# EAGLE design Oh_Oh-BOT_v001 (EAGLE 5.06)
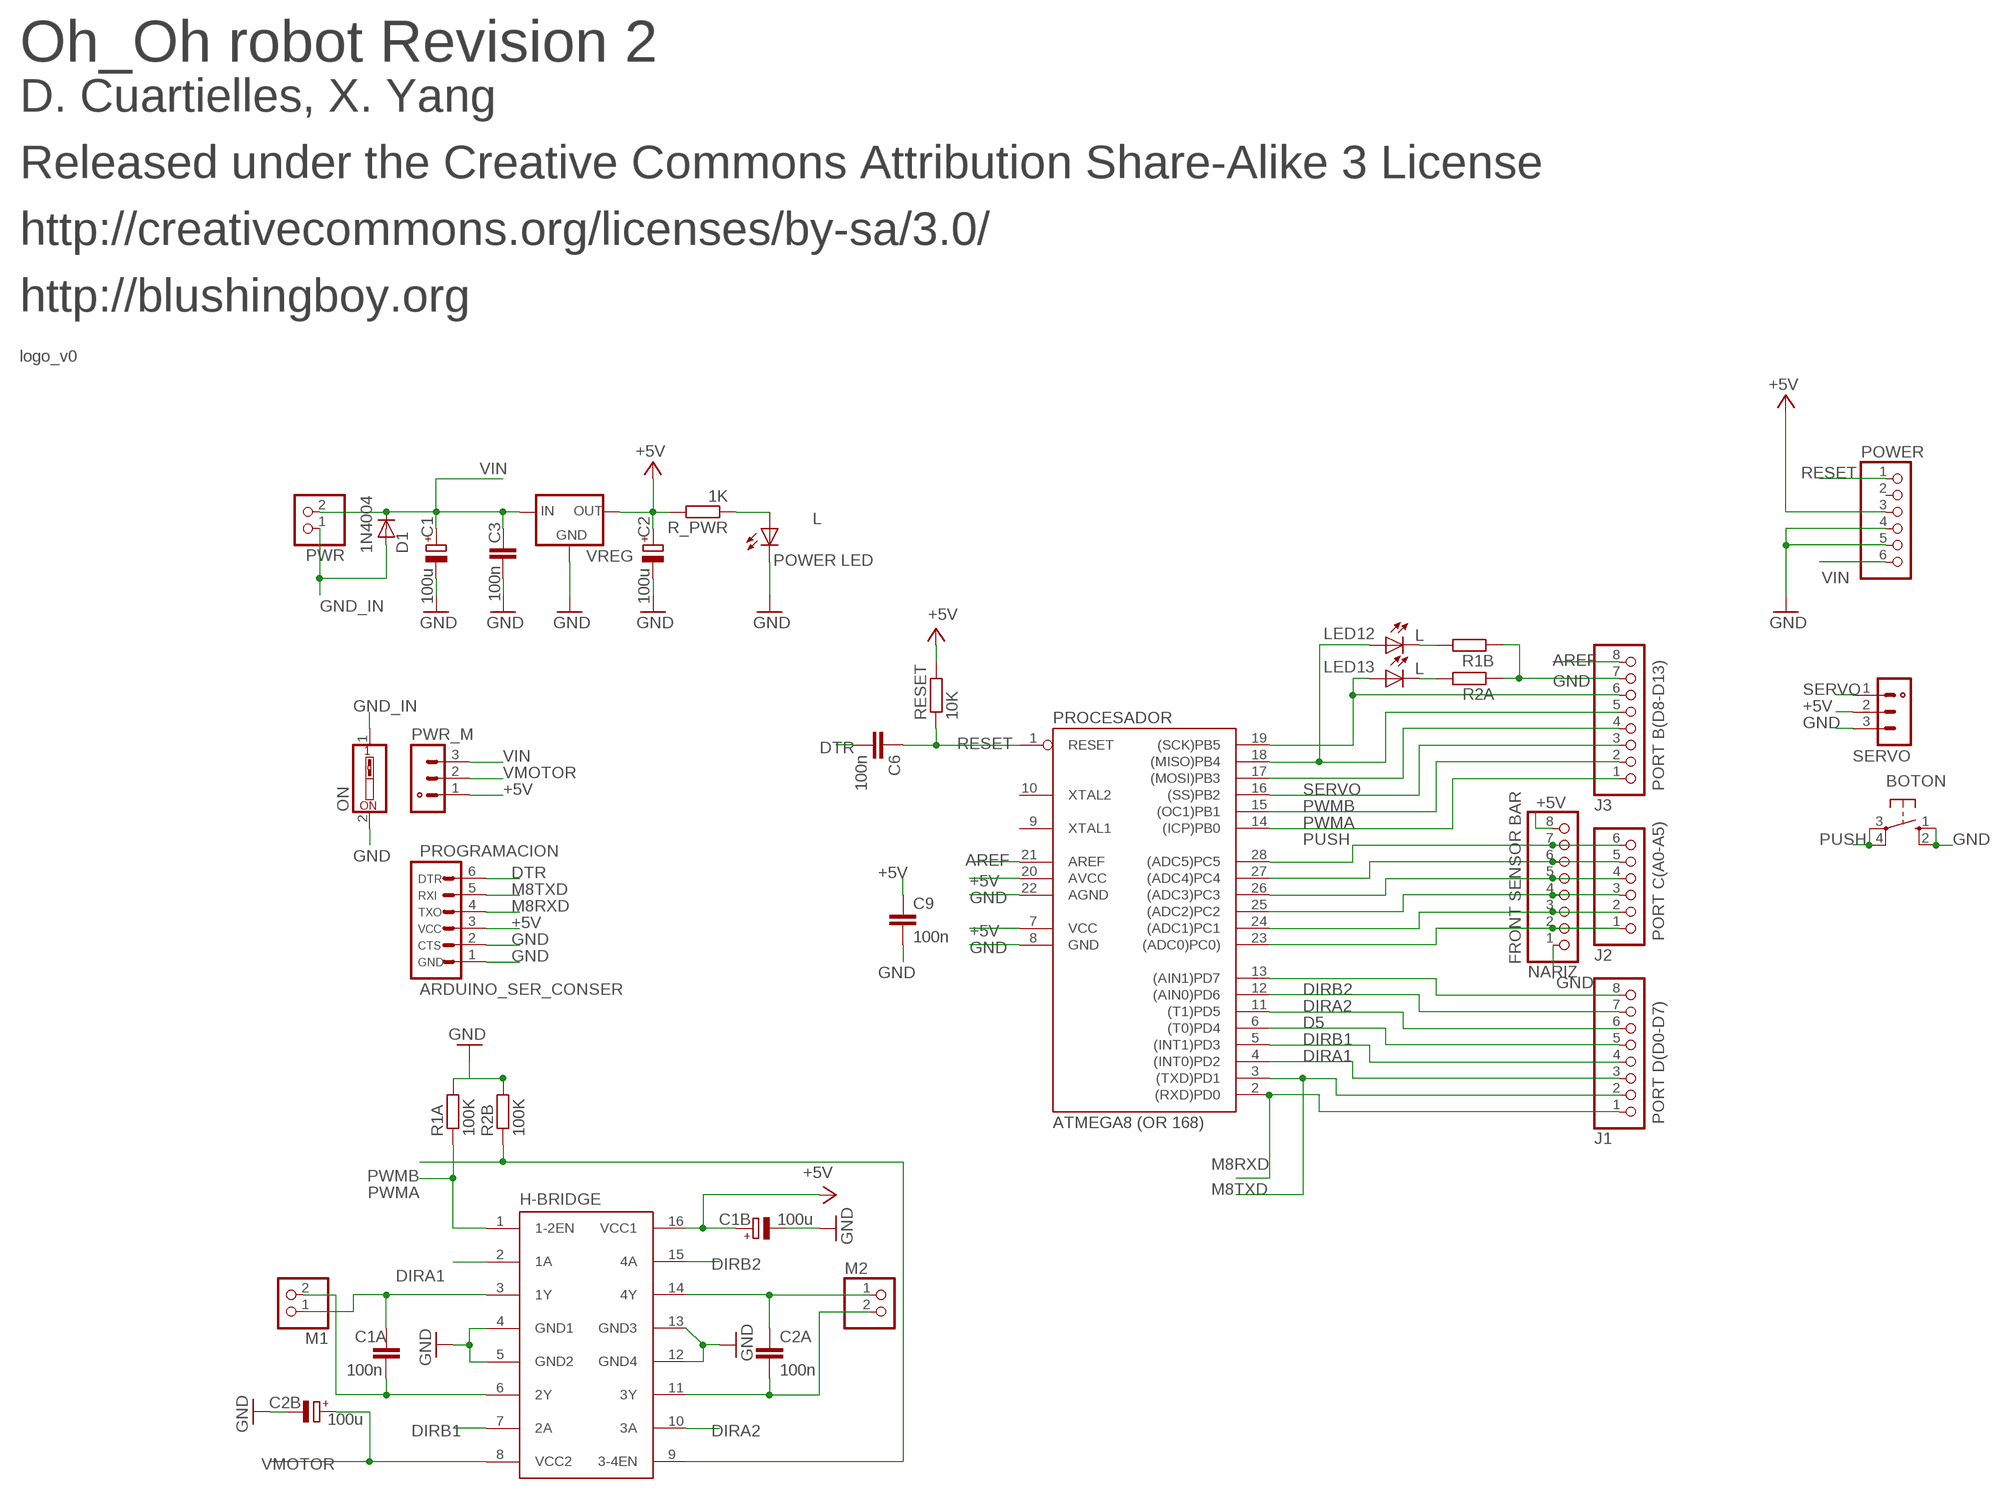
[diagram p0: schematic, sheet 1]

## Parts
BOTON  10-XX  [B3F-10XX]
C1  100u  C-POLE3,5-8  [E3,5-8]
C1A  100n  CC050X075_ARTY  [C050-025X075_ARTY]
C1B  100u  C-POLE3,5-8  [E3,5-8]
C2  100u  C-POLE3,5-8  [E3,5-8]
C2A  100n  CC050X075_ARTY  [C050-025X075_ARTY]
C2B  100u  C-POLE3,5-8  [E3,5-8]
C3  100n  CC050X075_ARTY  [C050-025X075_ARTY]
C6  100n  CC050X075_ARTY  [C050-025X075_ARTY]
C9  100n  CC050X075_ARTY  [C050-025X075_ARTY]
D1  1N4004  [DO41-10]
H-BRIDGE  L293E  [DIL16]
J1  PORT D(D0-D7)  PINHD-1X8  [1X08]
J2  PORT C(A0-A5)  PINHD-1X6  [1X06]
J3  PORT B(D8-D13)  PINHD-1X8  [1X08]
L  POWER LED  LED3MM  [LED3MM]
LED12  L  LED3MM  [LED3MM]
LED13  L  LED3MM  [LED3MM]
M1  PINHD-1X2  [1X02]
M2  PINHD-1X2  [1X02]
NARIZ  FRONT SENSOR BAR  PINHD-1X8  [1X08]
ON  SW_DIP-1  [EDG-01]
POWER  PINHD-1X6  [1X06]
PROCESADOR  ATMEGA8 (OR 168)  AT90S4433P  [DIL28-3]
PROGRAMACION  ARDUINO_SER_CONSER  [ARDUINO_SER_COM]
PWR  PINHD-1X2  [1X02]
PWR_M  MA03-1_BB  [MA03-1_BB]
R1A  100K  RR0207/10  [R0207/10]
R1B  RR0207/10  [R0207/10]
R2A  RR0207/10  [R0207/10]
R2B  100K  RR0207/10  [R0207/10]
R_PWR  1K  RR0207/10  [R0207/10]
RESET  10K  RR0207/10  [R0207/10]
SERVO  MA03-1_BB  [MA03-1_BB]
U$4  LOGO_V0  [LOGO_V0]
VREG  78XXS  [78XXS]

## Nets
+5V [power]: C1B.+ C2.+ C9.1 H-BRIDGE.16(VCC1) NARIZ.8 POWER.3 PROCESADOR.7(VCC) PROCESADOR.20(AVCC) PROGRAMACION.3 PWR_M.1 R_PWR.2 RESET.2 SERVO.2 VREG.OUT
AREF: J3.8 PROCESADOR.21(AREF)
D5: J1.6 PROCESADOR.11((T1)PD5)
DIRA1: H-BRIDGE.2(1A) J1.4 PROCESADOR.5((INT1)PD3)
DIRA2: H-BRIDGE.10(3A) J1.7 PROCESADOR.12((AIN0)PD6)
DIRB1: H-BRIDGE.7(2A) J1.5 PROCESADOR.6((T0)PD4)
DIRB2: H-BRIDGE.15(4A) J1.8 PROCESADOR.13((AIN1)PD7)
DTR: C6.2 PROGRAMACION.6
GND: BOTON.1(S) BOTON.2(S1) C1.- C1B.- C2.- C2B.- C3.2 C9.2 H-BRIDGE.4(GND1) H-BRIDGE.5(GND2) H-BRIDGE.12(GND4) H-BRIDGE.13(GND3) J3.7 L.K(C) NARIZ.1 ON.2 POWER.4 POWER.5 PROCESADOR.8(GND) PROCESADOR.22(AGND) PROGRAMACION.1 PROGRAMACION.2 R1A.2 R1B.1 R2A.1 R2B.2 SERVO.3 VREG.GND
GND_IN: D1.A ON.1 PWR.1
M8RXD: J1.1 PROCESADOR.2((RXD)PD0) PROGRAMACION.4
M8TXD: J1.2 PROCESADOR.3((TXD)PD1) PROGRAMACION.5
N$2: C1A.1 H-BRIDGE.3(1Y) M1.1
N$3: L.A R_PWR.1
N$5: LED12.K(C) R1B.2
N$9: C1A.2 H-BRIDGE.6(2Y) M1.2
N$10: J1.3 PROCESADOR.4((INT0)PD2)
N$16: J2.1 NARIZ.2 PROCESADOR.23((ADC0)PC0))
N$17: J2.2 NARIZ.3 PROCESADOR.24((ADC1)PC1)
N$18: J2.3 NARIZ.4 PROCESADOR.25((ADC2)PC2)
N$19: J2.4 NARIZ.5 PROCESADOR.26((ADC3)PC3)
N$20: J2.5 NARIZ.6 PROCESADOR.27((ADC4)PC4)
N$21: J2.6 NARIZ.7 PROCESADOR.28((ADC5)PC5)
N$31: LED13.K(C) R2A.2
N$32: C2A.2 H-BRIDGE.11(3Y) M2.2
N$33: C2A.1 H-BRIDGE.14(4Y) M2.1
PUSH: BOTON.3(P) BOTON.4(P1) J3.1 PROCESADOR.14((ICP)PB0)
PWMA: H-BRIDGE.1(1-2EN) J3.2 PROCESADOR.15((OC1)PB1) R1A.1
PWMB: H-BRIDGE.9(3-4EN) J3.3 PROCESADOR.16((SS)PB2) R2B.1
RESET: C6.1 POWER.1 PROCESADOR.1(RESET) RESET.1
SCK: J3.6 LED13.A PROCESADOR.19((SCK)PB5)
SCK1: J3.5 LED12.A PROCESADOR.18((MISO)PB4)
SERVO: J3.4 PROCESADOR.17((MOSI)PB3) SERVO.1
VIN [power]: C1.+ C3.1 D1.C POWER.6 PWR.2 PWR_M.3 VREG.IN
VMOTOR: C2B.+ H-BRIDGE.8(VCC2) PWR_M.2
Unconnected: POWER.2 PROCESADOR.9(XTAL1) PROCESADOR.10(XTAL2)

## Notes on the sheet
- Oh_Oh robot Revision 2
- D. Cuartielles, X. Yang
- Released under the Creative Commons Attribution Share-Alike 3 License
- http://creativecommons.org/licenses/by-sa/3.0/
- http://blushingboy.org

## Library data of the parts
BOTON = switch-omron:10-XX: OMRON SWITCH
C1 C1B C2 C2B = blushingboy_experimental:C-POL
C1A C2A C3 C6 C9 = blushingboy_experimental:C
D1 = diode:1N4004: DIODE general purpose rectifier, 1 A
H-BRIDGE = texas:L293E: TI DEVICE
J1 J3 NARIZ = pinhead:PINHD-1X8: PIN HEADER
J2 POWER = pinhead:PINHD-1X6: PIN HEADER
L LED12 LED13 = led:LED: LED OSRAM: - CHIPLED LG R971, LG N971, LY N971, LG Q971, LY Q971, LO R971, LY R971 LH N974, LH R974 LS Q976, LO Q976, LY Q976 LO Q996 - Hyper CHIPLED LW Q18S LB Q993, LB Q99A, LB R99A - SideLED LS A670, LO A670, LY A670, LG A670, LP A670 LB A673, LV A673, LT A673, LW A673 LH A674 LY A675 LS A676, LA A676, LO A676, LY A676, LW A676 LS A679, LY A679, LG A679 - Hyper Micro SIDELED® LS Y876, LA Y876, LO Y876, LY Y876 LT Y87S - SmartLED LW L88C, LW L88S LB L89C, LB L89S, LG L890 LS L89K, LO L89K, LY L89K LS L896, LA L896, LO L896, LY L896 - TOPLED LS T670, LO T670, LY T670, LG T670, LP T670 LSG T670, LSP T670, LSY T670, LOP T670, LYG T670 LG T671, LOG T671, LSG T671 LB T673, LV T673, LT T673, LW T673 LH T674 LS T676, LA T676, LO T676, LY T676, LB T676, LH T676, LSB T676, LW T676 LB T67C, LV T67C, LT T67C, LS T67K, LO T67K, LY T67K, LW E67C LS E67B, LA E67B, LO E67B, LY E67B, LB E67C, LV E67C, LT E67C LW T67C LS T679, LY T679, LG T679 LS T770, LO T770, LY T770, LG T770, LP T770 LB T773, LV T773, LT T773, LW T773 LH T774 LS E675, LA E675, LY E675, LS T675 LS T776, LA T776, LO T776, LY T776, LB T776 LHGB T686 LT T68C, LB T68C - Hyper Mini TOPLED® LB M676 - Mini TOPLED Santana® LG M470 LS M47K, LO M47K, LY M47K Source: http://www.osram.convergy.de/
M1 M2 PWR = pinhead:PINHD-1X2: PIN HEADER
ON = special:SW_DIP-1: DIP SWITCH
PROCESADOR = atmel:AT90S4433: MICROCONTROLLER 4 Kbytes FLASH 128 bytes SRAM 256 bytes EEPROM UART 6-channel 10 bit ADC
PROGRAMACION = SparkFun:ARDUINO_SER_CON
PWR_M SERVO = blushingboy_experimental:MA03-1_BB
R1A R1B R2A R2B R_PWR RESET = blushingboy_experimental:R
U$4 = blushingboy_experimental:LOGO_V0
VREG = v-reg:78XXS: VOLTAGE REGULATOR

## Net classes
1 power: width 0.61 mm

## Board
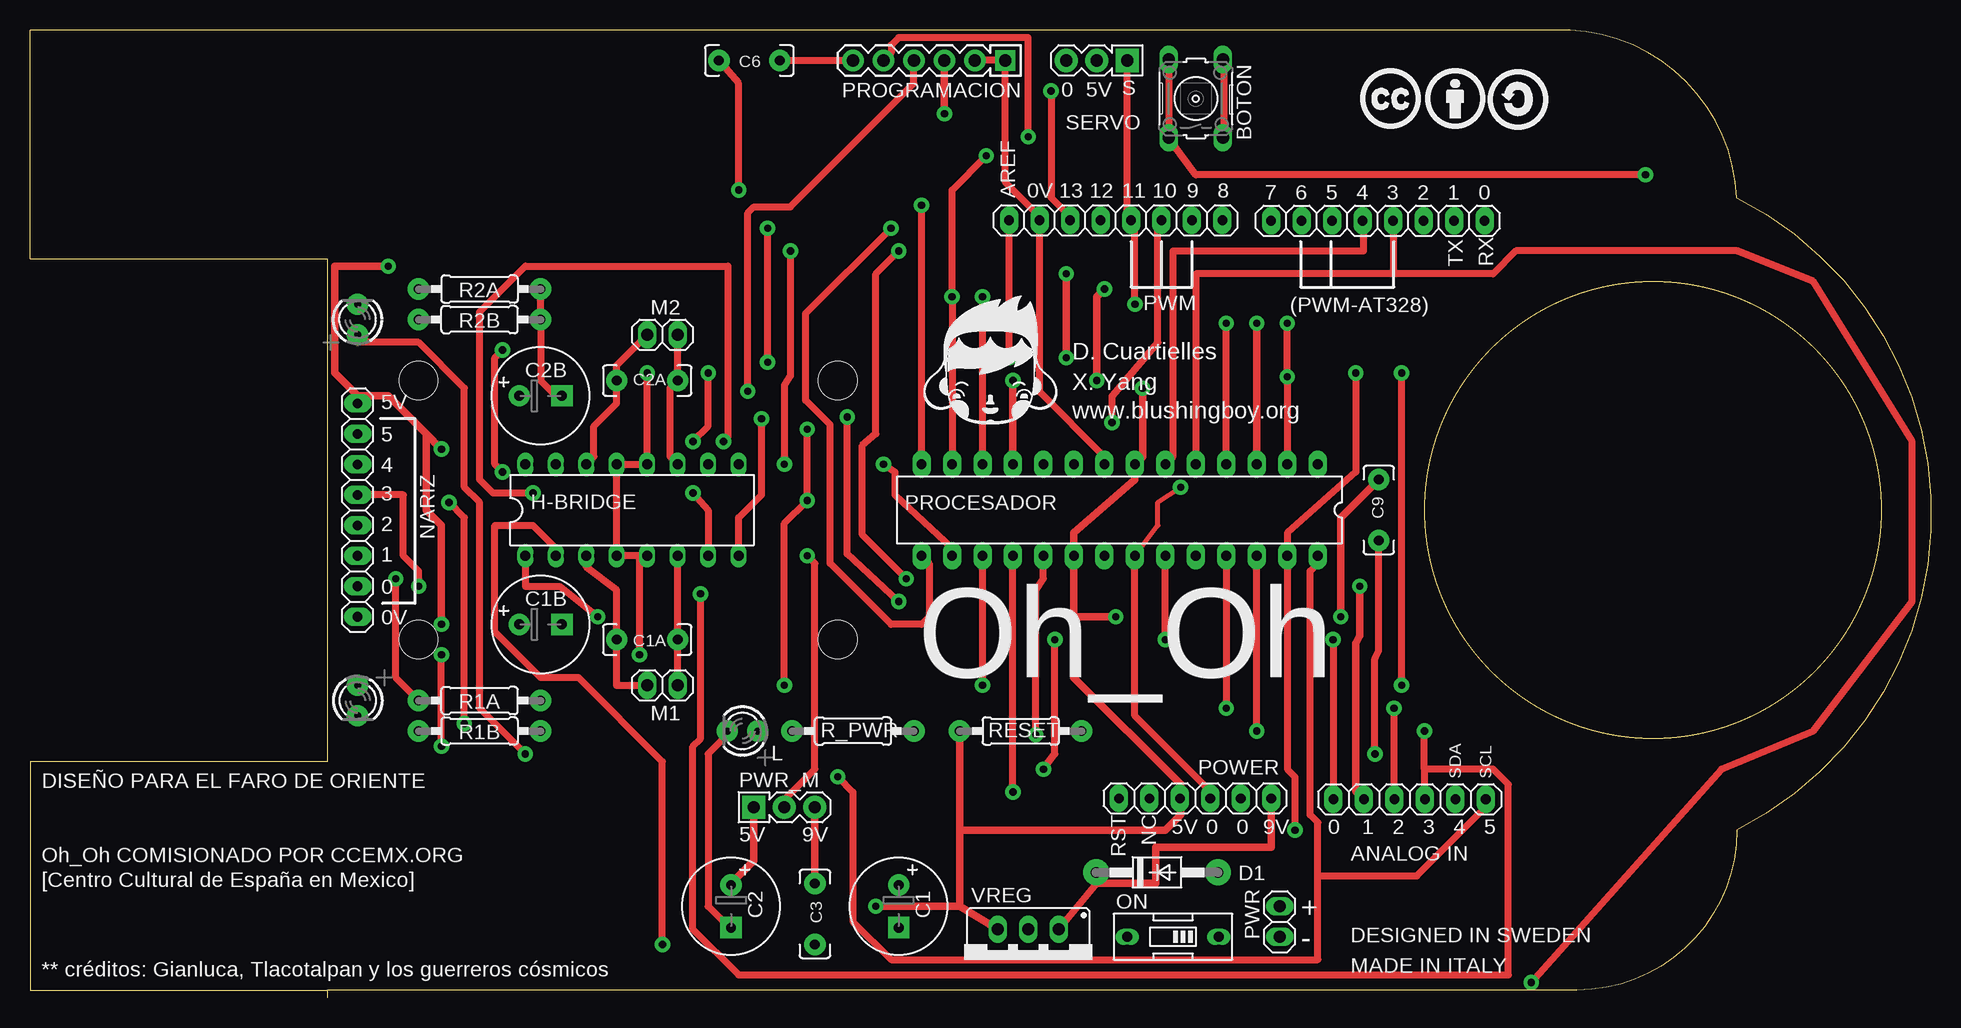
[diagram p1: board, top side]
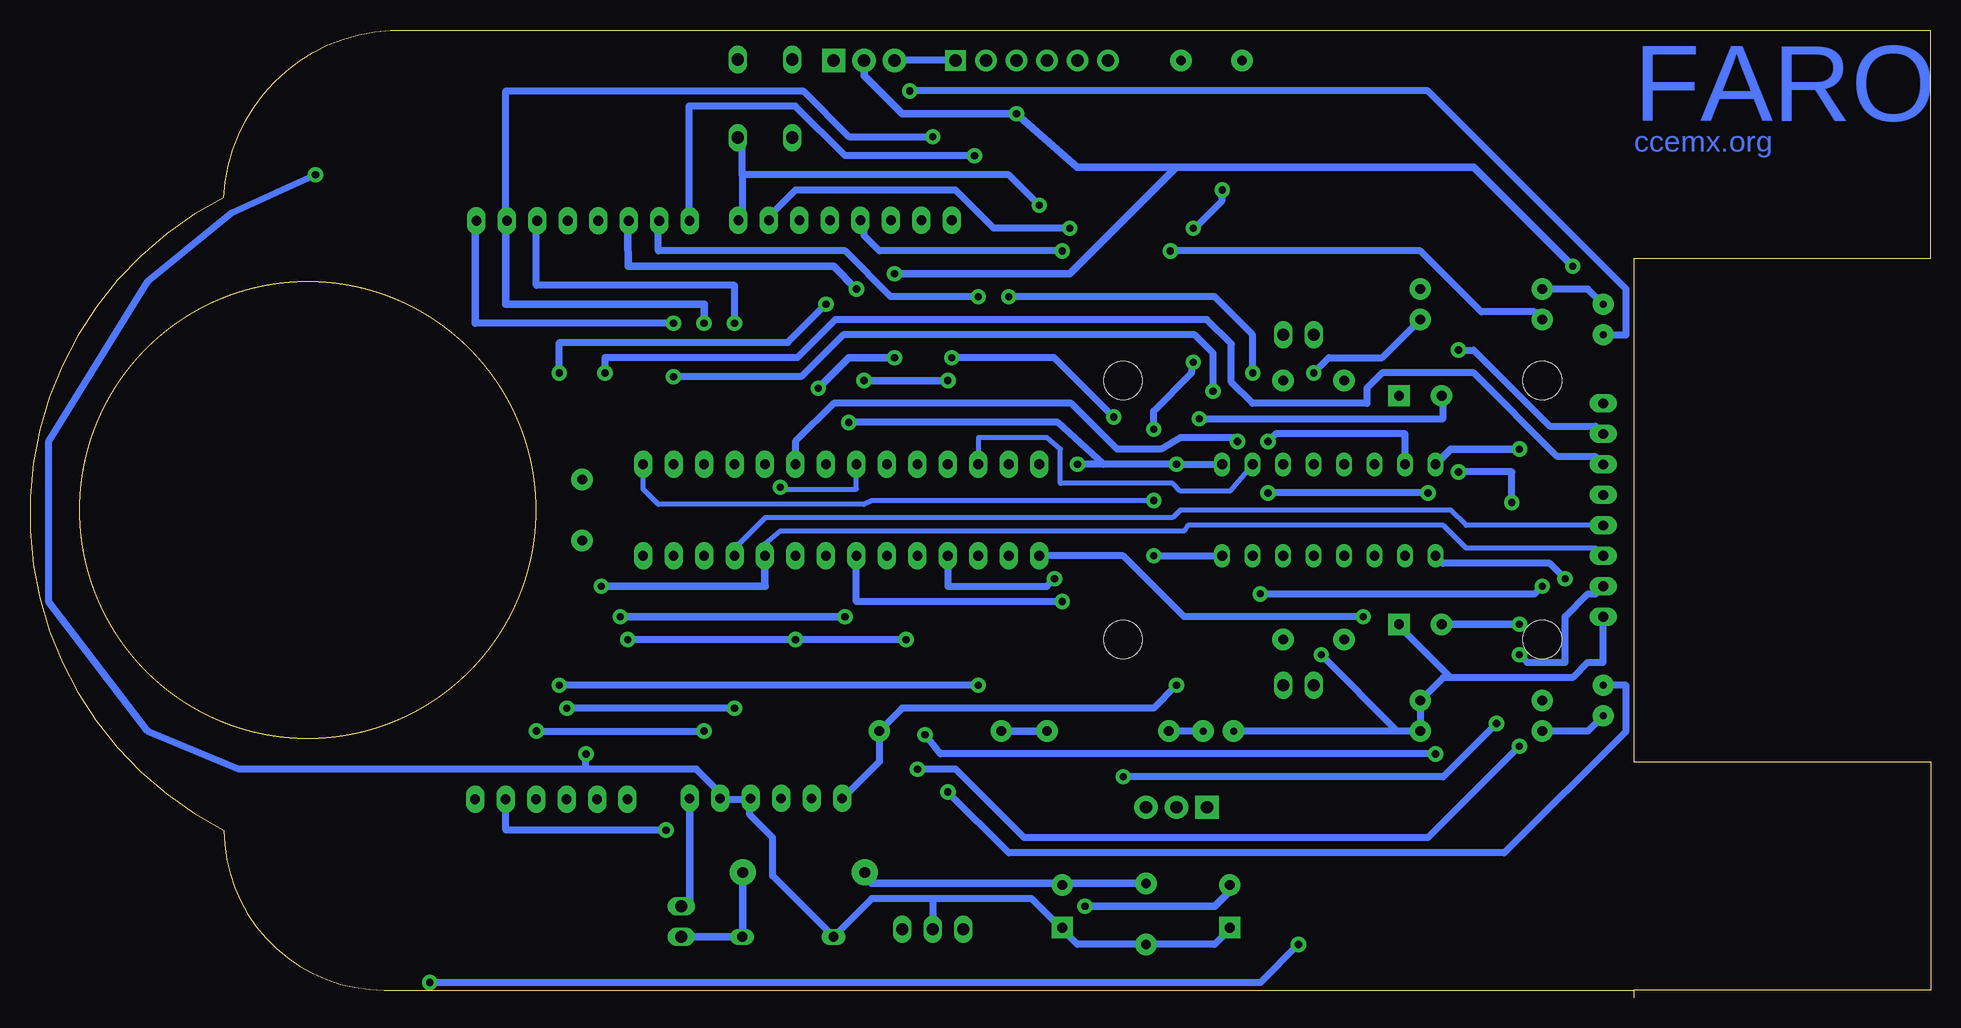
[diagram p2: board, bottom side, seen from below]

Size 158.41 x 80.65 mm. Coordinates in mm from the lower left corner, seen from the top.
Outline: 142.24,13.97 arc-90 128.91,0.64 24.77,0.64
Outline: 142.24,66.68 arc-126 142.24,13.97
Outline: 142.24,66.68 arc-126 142.24,13.97
Outline: 142.24,66.68 arc90 127,80.65 0,80.65 0,61.59 24.77,61.59 24.77,19.69 0,19.69 0,0.64 24.77,0.64
Outline: 24.77,0.64 24.77,0
Outline: circle at 135.25,40.64 radius 19
Copper layers (1*16): Top 0.035mm / dielectric 1.5mm / Bottom 0.035mm
Design rules "gizmo *": minimum track width 0.6mm, minimum drill 0.6mm, track to track 0.5mm, track to pad 0.5mm, pad to pad 0.5mm, via to via 0.5mm, smd to smd 0mil, copper to edge 0mil, drill to drill 8mil, minimum pad ring 10mil, minimum via ring 8mil, stop-mask expansion 0mil, vias tented up to drill 0mil, thermal gap 10mil
Holes 3.2 mm at 67.31,51.43 67.31,29.85 32.38,51.43 32.38,29.85
tRestrict: area -3.2,0.6 to 34.3,19.7; area -5.1,61.6 to 35.6,85.1; area 14.6,-8.9 to 139.7,0.6; area 52.1,80.6 to 150.5,85.7; area 25.4,61.6 to 53.3,82.6; area 24.8,0.6 to 52.1,19.7; area 115.3,20.6 to 155.3,60.6
bRestrict: area 51.4,81.3 to 150.5,85.7; area 14.6,-8.9 to 139.7,0.6; area 106.4,20.6 to 146.4,60.6; 6 lines
Milling: area 116.3,21.6 to 154.3,59.6

### Footprints (pad centres in the part's own frame; a part is rotated, then mirrored left to right if it is on the bottom)
B3F-10XX = drill 1.016 long: 1 -3.251,2.261; 2 3.251,2.261; 3 -3.251,-2.261; 4 3.251,-2.261
E3,5-8 = drill 0.813 pad 1.778 round: + -0.508,0 | drill 0.813 pad 1.778 square: - 3.048,0
C050-025X075_ARTY = drill 0.813 pad 1.778 round: 1 1.27,2.54; 2 6.35,2.54
DO41-10 = drill 0.9 pad 2.159 round: A 5.08,0; C -5.08,0
DIL16 = drill 0.813 long: 1 -8.89,-3.81; 2 -6.35,-3.81; 3 -3.81,-3.81; 4 -1.27,-3.81; 5 1.27,-3.81; 6 3.81,-3.81; 7 6.35,-3.81; 8 8.89,-3.81; 9 8.89,3.81; 10 6.35,3.81; 11 3.81,3.81; 12 1.27,3.81; 13 -1.27,3.81; 14 -3.81,3.81; 15 -6.35,3.81; 16 -8.89,3.81
1X08 = drill 0.8 pad 1.524 long: 1 -8.89,0; 2 -6.35,0; 3 -3.81,0; 4 -1.27,0; 5 1.27,0; 6 3.81,0; 7 6.35,0; 8 8.89,0
1X06 = drill 0.8 pad 1.524 long: 1 -6.35,0; 2 -3.81,0; 3 -1.27,0; 4 1.27,0; 5 3.81,0; 6 6.35,0
LED3MM = drill 0.6 pad 1.778 round: A -1.27,0; K 1.27,0
1X02 = drill 1.016 long: 1 -1.27,0; 2 1.27,0
EDG-01 = drill 0.813 long: 1 0,-3.81; 2 0,3.81
DIL28-3 = drill 0.813 pad 1.524 long: 1 -16.51,-3.81; 2 -13.97,-3.81; 3 -11.43,-3.81; 4 -8.89,-3.81; 5 -6.35,-3.81; 6 -3.81,-3.81; 7 -1.27,-3.81; 8 1.27,-3.81; 9 3.81,-3.81; 10 6.35,-3.81; 11 8.89,-3.81; 12 11.43,-3.81; 13 13.97,-3.81; 14 16.51,-3.81; 15 16.51,3.81; 16 13.97,3.81; 17 11.43,3.81; 18 8.89,3.81; 19 6.35,3.81; 20 3.81,3.81; 21 1.27,3.81; 22 -1.27,3.81; 23 -3.81,3.81; 24 -6.35,3.81; 25 -8.89,3.81; 26 -11.43,3.81; 27 -13.97,3.81; 28 -16.51,3.81
ARDUINO_SER_COM = drill 1.016 pad 1.676 square: 1 0,0 | drill 1.016 pad 1.778 round: 2 2.54,0; 3 5.08,0; 4 7.62,0; 5 10.16,0; 6 12.7,0
MA03-1_BB = drill 1.016 pad 1.93 square: 1 -2.54,0 | drill 1.016 pad 1.93 round: 2 0,0; 3 2.54,0
R0207/10 = drill 0.813 pad 1.778 round: 1 0,0; 2 10.16,0
78XXS = drill 1.016 long: GND 0,-2.54; IN -2.54,-2.54; OUT 2.54,-2.54

### Placement (x,y rotation side)
BOTON  97.16,74.93 90 top
C1  72.39,8.89 270 top
C1A  47.62,27.31 0 top
C1B  41.28,31.12 0 top
C2  58.42,8.89 270 top
C2A  47.62,48.89 0 top
C2B  41.28,50.16 0 top
C3  62.87,10.79 270 top
C6  56.13,75.57 0 top
C9  109.86,44.45 270 top
D1  93.92,10.44 0 top
H-BRIDGE  50.16,40.64 0 top
J1  112.32,64.75 180 top
J2  114.97,16.54 0 top
J3  90.48,64.79 180 top
L  59.37,22.22 180 top
LED12  27.3,24.77 270 top
LED13  27.3,56.52 90 top
M1  52.7,26.04 0 top
M2  52.7,55.24 0 top
NARIZ  27.3,40.64 90 top
ON  95.25,5.08 90 top
POWER  97.09,16.62 0 top
PROCESADOR  90.81,40.64 180 top
PROGRAMACION  81.28,78.11 180 top
PWR  104.14,6.35 90 top
PWR_M  62.87,15.88 0 top
R1A  32.38,24.77 0 top
R1B  42.55,22.23 180 top
R2A  42.55,59.05 180 top
R2B  32.38,56.52 0 top
R_PWR  63.5,22.23 0 top
RESET  87.63,22.23 180 top
SERVO  88.9,78.11 180 top
U$1  [CC]  110.81,72.39 0 top
U$2  [BY]  116.2,72.39 0 top
U$3  [SA]  121.44,72.39 0 top
U$4  74.45,47.78 0 top
VREG  83.19,3.17 180 top

### Tracks (layer width: path | path; a pad name or v marks a point on that pad's centre or on a via)
+5V  (via drill 0.6 pad 1.27)
  Top 0.61: PWR_M.1 60.33,11.43 58.42,9.53 C2.+ | 77.47,7.62 VREG.OUT | 77.47,17.15 RESET.2 | 77.47,13.97 77.47,17.15 | 77.47,13.97 77.47,7.62 | 77.47,7.62 v70.48,7.62 | 77.47,17.15 77.47,7.62 | 95.89,16.51 95.89,17.78 87,26.67 87,31.75 | 87,31.75 PROCESADOR.20 87,37.46 87,38.73 92.08,43.18 PROCESADOR.7 92.71,45.09 v92.71,50.8 | C9.1 109.22,40 v109.22,31.75 | 87,31.75 v90.49,31.75 | 77.47,13.97 94.61,13.97 95.89,15.24 95.89,16.51 | 95.89,16.51 POWER.3 | v76.2,73.66 PROGRAMACION.3 | 33.02,46.99 29.84,50.16 27.3,50.16 | 33.02,46.99 v34.29,45.72 | v34.29,31.12 34.29,39.37 33.02,40.64 33.02,46.99 | v29.84,60.96 25.4,60.96 25.4,52.07 27.3,50.16 | 27.3,50.16 NARIZ.8 | v86.36,60.32 v86.36,53.34
  Bottom 0.61: RESET.2 R_PWR.2 | v70.48,7.62 59.69,7.62 58.42,8.89 C2.+ | v90.49,31.75 v109.22,31.75 | SERVO.2 88.9,76.84 85.72,73.66 v76.2,73.66 71.12,69.22 62.87,69.22 | H-BRIDGE.16 40.01,45.72 v34.29,45.72 | v34.29,31.12 C1B.+ | 62.87,69.22 38.1,69.22 v29.84,60.96 | v92.71,50.8 90.17,53.34 v86.36,53.34 | v86.36,60.32 71.75,60.32 62.87,69.22
AREF  (via drill 0.6 pad 1.27)
  Top 0.6: v72.39,33.02 68.1,36.99 v68.1,48.39 | v81.6,53.34 81.6,64.77 J3.8
  Bottom 0.6: v72.39,33.02 89.53,33.02 PROCESADOR.21 | v68.1,48.39 73.06,53.34 v81.6,53.34
D5  (via drill 0.6 pad 1.27)
  Top 0.61: v89.53,59.05 88.9,58.42 v88.9,51.43 | v81.91,51.43 v81.92,51.43 PROCESADOR.11
  Bottom 0.61: J1.6 108.58,64.75 108.58,63.5 108.53,60.96 91.44,60.96 v89.53,59.05 | v81.91,51.43 v88.9,51.43
DIRA1  (via drill 0.6 pad 1.27)
  Top 0.6: H-BRIDGE.2 43.81,37.46 41.91,39.37 38.73,39.37 38.73,30.48 42.55,26.67 45.72,26.67 52.7,19.69 v52.7,4.45 | v125.09,1.27 140.97,19.05 148.59,22.23 156.85,33.02 156.85,46.35 148.59,59.69 142.24,62.23 123.83,62.23 121.92,60.32 113.67,60.32 | 113.67,60.32 113.67,64.14 J1.4 | 113.67,60.32 97.16,60.32 97.16,45.09 PROCESADOR.5
  Bottom 0.6: v52.7,4.45 55.88,1.27 v125.09,1.27
DIRA2  (via drill 0.6 pad 1.27)
  Top 0.6: v79.38,58.42 79.38,45.09 PROCESADOR.12
  Bottom 0.406: H-BRIDGE.10 58.42,42.23 62.55,42.23 63.18,42.86 72.55,42.86 72.55,45.72 73.66,46.67 79.38,46.67 PROCESADOR.12
  Bottom 0.6: PROCESADOR.12 | v79.38,58.42 86.68,58.42 90.49,62.23 106.05,62.23 106.05,63.82 J1.7
DIRB1  (via drill 0.6 pad 1.27)
  Top 0.6: H-BRIDGE.7 56.52,40.64 v55.25,42.07 | v41.91,42.07 38.58,42.07 37.47,43.18 37.47,57.15 41.28,60.96 58.17,60.96 58.17,46.74 v57.79,46.35 | J1.5 111.12,64.14 111.12,62.23 95.25,62.23 95.25,45.09 PROCESADOR.6
  Bottom 0.6: v41.91,42.07 v55.25,42.07 | v57.79,46.35 58.1,46.67 62.55,46.67 64.13,45.72 67.82,45.72 71.63,49.53 91.44,49.53 94.61,46.35 94.61,45.09 PROCESADOR.6
DIRB2  (via drill 0.6 pad 1.27)
  Top 0.6: v55.25,46.35 56.52,47.62 v56.52,52.07 | PROCESADOR.13 76.84,45.09 v76.84,58.42 76.84,67.31 v79.69,70.17
  Bottom 0.6: H-BRIDGE.15 43.81,46.99 54.61,46.99 v55.25,46.35 | v56.52,52.07 56.52,55.24 59.69,58.42 62.87,58.42 v76.84,58.42 | v79.69,70.17 90.49,70.17 94.61,74.3 103.5,74.3 103.5,65.41 J1.8
DTR
  Top 0.6: C6.2 PROGRAMACION.6
GND  (via drill 0.6 pad 1.27)
  Top 0.406: v95.89,42.54 93.98,41.27 93.98,39.37 PROCESADOR.22
  Top 0.6: R2A.1 R2B.2 42.55,51.43 43.81,50.16 C2B.- | 50.8,36.83 H-BRIDGE.4 H-BRIDGE.13 H-BRIDGE.12 v51.44,52.07 | v50.8,28.58 50.8,36.83 | 50.8,36.83 H-BRIDGE.5 | PROCESADOR.8 89.53,45.09 84.14,50.48 84.14,64.77 J3.7 83.82,65.41 81.28,67.95 PROGRAMACION.1 PROGRAMACION.2 | BOTON.2 94.93,78.11 94.93,71.76 BOTON.1 95.25,71.12 97.16,68.58 v134.62,68.58 | PROCESADOR.22 92.08,23.5 98.42,17.15 POWER.4 | v112.08,20.32 112.08,28.26 112.39,28.89 C9.2 | L.K 57.79,21.59 56.52,20.32 56.52,7.62 58.42,5.71 C2.-
  Bottom 0.406: v95.89,42.54 95.41,42.39 89.53,42.39 PROCESADOR.8
  Bottom 0.6: NARIZ.1 27.3,27.94 28.57,27.94 29.84,26.67 40.01,26.67 | 40.01,26.67 40.64,26.67 R1A.2 R1B.1 44.45,22.23 | 40.01,26.67 44.45,31.12 C1B.- | 44.45,22.23 57.79,22.23 L.K | 44.45,22.23 v50.8,28.58 | R2B.2 45.72,53.34 50.16,53.34 v51.44,52.07 | PROGRAMACION.1 SERVO.3 | C2.- 58.42,5.71 59.69,4.45 C3.2 71.12,4.45 72.39,5.71 C1.- 73.03,6.35 74.93,8.26 83.19,8.26 | 98.42,16.51 98.42,15.24 96.52,13.33 96.52,10.16 ON.2 88.27,8.26 83.19,8.26 | 83.19,8.26 VREG.GND | 98.42,16.51 100.33,16.51 POWER.5 100.97,17.15 102.87,19.05 112.08,19.05 | 98.42,16.51 POWER.4 | 112.08,19.05 v112.08,20.32 | v134.62,68.58 141.61,65.41 148.59,59.69 156.85,46.35 156.85,33.02 148.59,22.23 140.97,19.05 112.08,19.05
GND_IN
  Bottom 0.61: PWR.1 ON.1 99,5.08 D1.A
M8RXD  (via drill 0.6 pad 1.27)
  Top 0.6: v104.78,56.2 v104.78,51.75 104.78,45.09 PROCESADOR.2 | PROGRAMACION.4 73.66,76.2 63.37,65.91 60.33,65.91 59.82,65.41 v59.82,50.55
  Bottom 0.6: v104.78,56.2 121.28,56.2 | v59.82,50.55 59.82,53.72 61.34,55.24 90.65,55.24 94.14,51.75 v104.78,51.75
  Bottom 0.61: J1.1 121.28,64.67 121.28,56.2
M8TXD  (via drill 0.6 pad 1.27)
  Top 0.6: PROGRAMACION.5 71.75,78.74 71.75,79.38 72.39,80.01 83.19,80.01 v83.19,71.76
  Top 0.61: v102.23,56.2 102.24,55.88 PROCESADOR.3
  Bottom 0.6: v83.19,71.76 90.17,71.76 93.98,75.57 118.75,75.57 118.75,64.77 J1.2
  Bottom 0.61: J1.2 118.75,64.67 118.75,57.78 102.23,57.78 v102.23,56.2
N$2
  Top 0.6: H-BRIDGE.3 46.36,35.88 48.89,33.97 C1A.1 48.89,26.04 M1.1
N$3
  Bottom 0.6: R_PWR.1 60.96,22.23 L.A
N$5
  Bottom 0.6: LED12.K 28.57,22.23 R1B.2
N$9
  Top 0.6: H-BRIDGE.6 C1A.2 M1.2
N$10  (via drill 0.6 pad 1.27)
  Top 0.6: v99.7,56.2 99.7,45.09 PROCESADOR.4
  Bottom 0.6: v99.7,56.2 99.7,59.37 116.2,59.37 116.2,64.14 J1.3
N$16  (via drill 0.6 pad 1.27)
  Top 0.6: v34.29,20.96 v34.29,28.58 | v84.45,19.05 85.41,20.32 v85.41,29.85 | v94.61,29.85 PROCESADOR.23 | v108.58,29.85 108.58,17.15 J2.1
  Bottom 0.6: NARIZ.2 27.94,33.66 28.57,33.66 30.48,31.75 30.48,27.94 33.66,27.94 v34.29,28.58 | v34.29,20.96 41.91,13.33 75.56,13.33 81.28,19.05 v84.45,19.05 | v85.41,29.85 v94.61,29.85 v108.58,29.85
N$17  (via drill 0.6 pad 1.27)
  Top 0.61: J2.2 110.49,17.2 110.49,29.53 110.81,30.16 v110.81,34.29
  Bottom 0.406: NARIZ.3 27.94,37.46 38.73,37.46 40.64,39.37 61.91,39.37 62.23,38.89 95.89,38.89 97.16,37.78 PROCESADOR.24
  Bottom 0.61: v110.81,34.29 97.16,34.29 PROCESADOR.24
N$18  (via drill 0.6 pad 1.27)
  Top 0.6: v113.67,24.13 113.67,17.15 J2.3 | v99.7,24.13 PROCESADOR.25
  Bottom 0.406: NARIZ.4 38.73,39.37 40.01,40.64 62.55,40.64 63.18,40 66.99,40 67.63,40 87.95,40 89.22,40 97.16,40 99.7,37.46 PROCESADOR.25
  Bottom 0.6: v99.7,24.13 v113.67,24.13
N$19  (via drill 0.6 pad 1.27)
  Top 0.6: 116.2,19.05 v116.2,22.23 | v102.23,22.23 PROCESADOR.26 | NARIZ.5 31.12,41.91 31.12,36.83 32.38,35.56 v32.38,34.29 | v55.88,33.66 55.88,21.59 55.25,20.96 55.25,5.71 59.05,1.91 123.19,1.91 123.19,17.78 121.92,19.05 116.2,19.05 | 116.2,19.05 116.2,17.15 J2.4
  Bottom 0.6: v116.2,22.23 v102.23,22.23 | v32.38,34.29 33.02,33.66 v55.88,33.66
N$20  (via drill 0.6 pad 1.27)
  Top 0.6: v105.41,13.97 105.41,18.42 104.78,19.05 PROCESADOR.27 104.78,37.46 104.78,38.73 110.49,43.81 v110.49,52.07
  Bottom 0.6: v105.41,13.97 118.75,13.97 118.75,16.51 J2.5 | NARIZ.6 27.94,45.09 31.12,45.09 38.1,52.07 45.72,52.07 46.99,50.8 46.99,49.53 56.52,49.53 58.29,51.31 58.29,54.48 60.33,56.52 91.28,56.52 94.46,53.34 110.49,53.34 v110.49,52.07
N$21  (via drill 0.6 pad 1.27)
  Top 0.6: 107.31,10.16 115.57,10.16 121.28,15.88 121.28,16.51 J2.6 | 107.31,10.16 107.31,14.61 106.68,15.24 106.68,35.56 107.31,36.2 PROCESADOR.28 | v39.37,53.98 38.73,53.34 38.73,44.45 v39.37,43.81 | v34.92,41.27 36.2,40 v36.2,22.86 | v67.31,18.42 68.58,17.15 68.58,6.35 71.75,3.17 107.31,3.17 107.31,10.16
  Bottom 0.6: NARIZ.7 27.94,47.62 31.75,47.62 38.1,53.98 v39.37,53.98 | v39.37,43.81 34.92,43.81 v34.92,41.27 | v36.2,22.86 40.64,18.42 v67.31,18.42
N$31
  Bottom 0.6: LED13.K 28.57,59.05 R2A.2
N$32
  Top 0.6: H-BRIDGE.11 53.34,45.09 53.34,50.8 C2A.2 M2.2
N$33
  Top 0.6: H-BRIDGE.14 46.99,45.09 46.99,47.62 48.89,49.53 C2A.1 48.89,52.7 M2.1
PUSH  (via drill 0.6 pad 1.27)
  Top 0.6: v74.3,66.04 74.3,45.09 PROCESADOR.14 | BOTON.4 99.54,78.11 99.54,71.76 BOTON.3
  Bottom 0.6: v74.3,66.04 76.84,68.58 99.06,68.58 | 99.06,68.58 99.06,71.12 BOTON.3 | 99.06,68.58 99.06,65.41 J3.1
PWMA  (via drill 0.6 pad 1.27)
  Top 0.6: v30.48,34.92 30.48,26.67 R1A.1 | v47.31,31.75 44.13,34.29 41.28,34.29 H-BRIDGE.1 | v71.75,64.14 64.64,57.02 64.64,49.78 66.67,47.75 66.67,36.2 71.75,31.12 74.3,31.12 74.93,31.75 74.93,36.2 PROCESADOR.15
  Bottom 0.6: H-BRIDGE.1 40.64,36.2 31.75,36.2 v30.48,34.92 | v47.31,31.75 62.23,31.75 67.31,36.83 PROCESADOR.15 | v71.75,64.14 78.11,64.14 81.28,67.31 94.61,67.31 96.52,65.41 J3.2
PWMB  (via drill 0.6 pad 1.27)
  Top 0.6: v71.12,44.45 72.07,43.81 72.07,41.91 76.84,37.46 PROCESADOR.16 | v90.17,47.94 90.17,50.16 93.98,54.61 93.98,64.77 J3.3 | v63.37,62.23 63.37,51.82 62.87,51.05 v62.87,44.45
  Bottom 0.6: 68.93,44.45 v71.12,44.45 | 68.93,44.45 v62.87,44.45 H-BRIDGE.9 | v90.17,47.94 72.74,47.94 68.93,44.45 | R2B.1 33.02,57.15 37.47,57.15 42.55,62.23 v63.37,62.23
RESET  (via drill 0.6 pad 1.27)
  Top 0.6: v62.87,26.04 62.87,39.53 v64.77,41.43 v64.77,47.37 | C6.1 59.05,76.2 v59.05,67.31 | v61.47,52.96 v61.47,64.14
  Bottom 0.406: v64.77,41.43 88.27,41.43 88.9,41.12 106.05,41.12 107.31,42.39 PROCESADOR.1
  Bottom 0.6: POWER.1 90.17,17.15 87.63,19.69 RESET.1 85.72,24.13 64.77,24.13 v62.87,26.04 | v61.47,64.14 61.34,64.14 59.05,66.42 v59.05,67.31 | v64.77,47.37 64.77,48.89 61.59,52.07 v61.47,52.96
SCK  (via drill 0.6 pad 1.27)
  Top 0.6: v83.82,21.91 83.82,33.97 84.45,34.92 PROCESADOR.19 | v41.28,20.32 37.47,24.13 37.47,41.27 36.2,42.54 36.2,50.8 32.38,54.61 27.3,54.61 LED13.A | v85.09,75.57 85.09,66.68 86.36,65.41 J3.6
  Bottom 0.6: v83.82,21.91 82.55,20.32 v41.28,20.32 | v85.09,75.57 41.91,75.57 25.4,59.05 25.4,55.24 LED13.A
SCK1  (via drill 0.6 pad 1.27)
  Top 0.6: v81.91,17.15 PROCESADOR.18 | v72.39,62.23 70.48,60.32 70.48,46.99 69.37,46.04 69.37,38.58 v73.03,34.92
  Bottom 0.6: v81.91,17.15 76.84,12.06 35.56,12.06 25.4,22.23 25.4,26.04 LED12.A | v72.39,62.23 87.63,62.23 88.9,63.5 88.9,64.77 J3.5 | v73.03,34.92 73.66,34.29 81.91,34.29 PROCESADOR.18
SERVO  (via drill 0.6 pad 1.27)
  Top 0.6: v79.38,26.04 PROCESADOR.17 | v114.3,26.04 v114.3,52.07 | v92.08,57.78 92.08,64.77 J3.4 91.44,65.41 SERVO.1
  Bottom 0.6: v79.38,26.04 v114.3,26.04 | v114.3,52.07 114.3,54.61 95.25,54.61 v92.08,57.78
VIN
  Top 0.61: C3.1 PWR_M.3 | 88.9,9.53 VREG.IN | 88.9,9.53 88.9,10.16 D1.C | 88.9,9.53 93.82,9.53 93.82,12.54 103.44,12.54 POWER.6
  Bottom 0.61: C3.1 72.39,9.53 | 88.9,10.16 D1.C 88.27,9.53 72.39,9.53 | 72.39,9.53 C1.+ | PWR.2 103.44,7.62 POWER.6
VMOTOR  (via drill 0.6 pad 1.27)
  Top 0.6: v64.77,36.83 65.41,36.2 65.41,19.05 62.87,16.51 PWR_M.2 | v60.96,48.26 60.96,41.91 59.05,40 H-BRIDGE.8
  Bottom 0.6: v64.77,36.83 H-BRIDGE.8 | v60.96,48.26 40.64,48.26 40.64,50.16 C2B.+

### Text on the board
Bottom: FARO | ccemx.org
tNames: S | 0 | 5V | AREF | 0V | 13 | 12 | 11 | 10 | 9 | 8 | 7 | 6 | 5 | 4 | 3 | 2 | 1 | 0 | TX | RX | PWM | (PWM-AT328) | D. Cuartielles | X. Yang | 5V | www.blushingboy.org | 5 | 4 | 3 | 2 | 1 | 0 | 0V | Oh_Oh | SDA | SCL | DISEÑO PARA EL FARO DE ORIENTE | 5V | 0 | 0 | 9V | 0 | 1 | 2 | 3 | 4 | 5 | 5V | 9V | NC | Oh_Oh COMISIONADO POR CCEMX.ORG | RST | ANALOG IN | [Centro Cultural de España en Mexico] | + | DESIGNED IN SWEDEN | - | ** créditos: Gianluca, Tlacotalpan y los guerreros cósmicos | MADE IN ITALY
bValues: ENABLE
bRestrict: Arduino | R.2 | V.3 | S3 | Pin0/1 | 2008 | REF | GND | SERIAL | ON | www.arduino.cc | AKASHI | A. | BANZI | M. | AUTO | CUARTIELLES | D. | CC BY SA 2.5 | RESET | ENABLE | MARTINO | G. | IGOE | T. | ZAMBETTI | N. | MELLIS | D.
tCredits: ADILSON AKASHI | MASSIMO BANZI | DAVID CUARTIELLES | TOM IGOE | GIANLUCA MARTINO | DAVID A. MELLIS | NICHOLAS ZAMBETTI | Released under the Creative Commons Attribution Share-Alike 2.5 License | http://creativecommons.org/licenses/by-sa/2.5/
Cooper Text: 13 | 12 | 11 | 10 | 9 | 8 | 7 | 6 | 5 | 4 | 3 | 2 | 1 | R | 5 | 0 | 0 | 9 | 0 | 1 | 2 | 3 | 4 | 5 | Analog in
bCredits: DAVID CUARTIELLES | Released under the Creative Commons Attribution Share-Alike 2.5 License | http://creativecommons.org/licenses/by-sa/2.5/